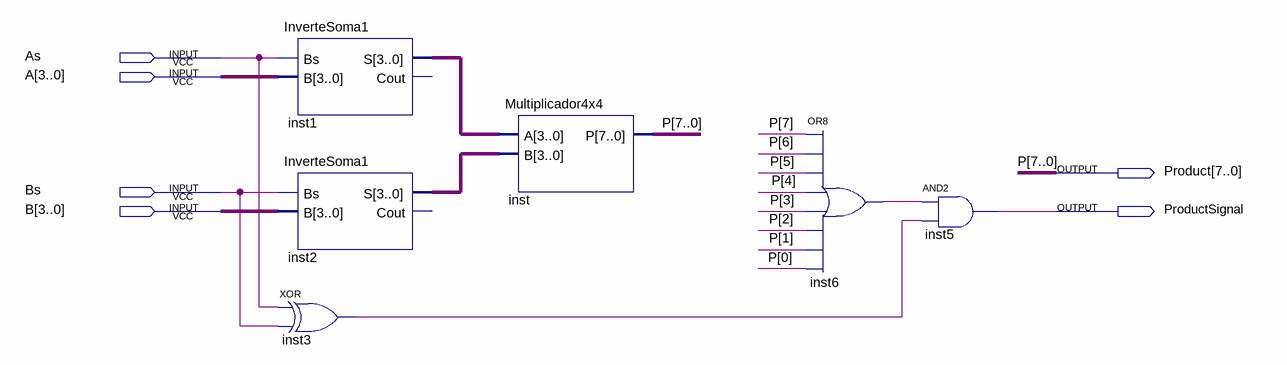
[diagram p0: schematic sheet]
// Quartus schematic MultiplicadorDe4BitsComSinal.bdf as structural Verilog: 6 symbols, 6 pins
module MultiplicadorDe4BitsComSinal (
  input  As,
  input  [3:0] A,
  input  Bs,
  input  [3:0] B,
  output [7:0] Product,
  output ProductSignal
);

  wire inst3_out, inst6_out;
  wire [3:0] inst1_s, inst2_s;

  InverteSoma1 inst1 (.Bs(As), .B(A), .S(inst1_s));  // open: Cout
  InverteSoma1 inst2 (.Bs(Bs), .B(B), .S(inst2_s));  // open: Cout
  xor inst3 (inst3_out, As, Bs);
  Multiplicador4x4 inst (.B(inst2_s), .A(inst1_s), .P(Product));
  or inst6 (inst6_out, Product[7], Product[6], Product[5], Product[4], Product[3], Product[2], Product[1], Product[0]);
  and inst5 (ProductSignal, inst6_out, inst3_out);

  // Other names for the same wires on the sheet: P[7:0] = Product
endmodule
